# Altium project BlueStone_Terminal_V2.11.PrjPCB
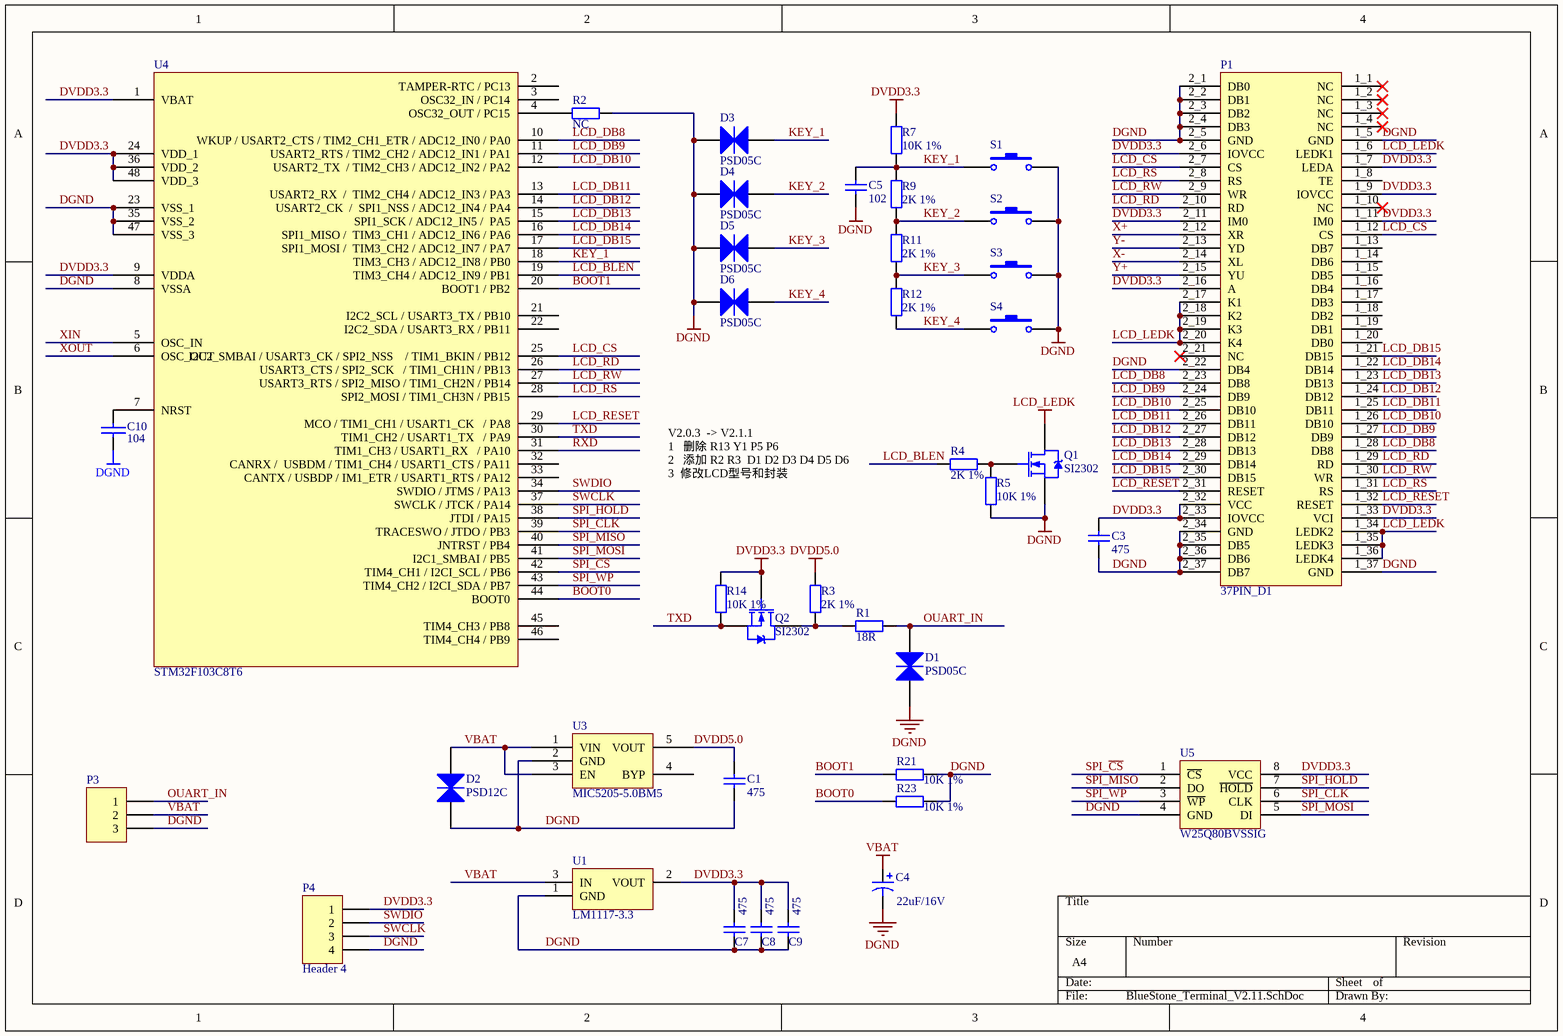
[diagram p0: BlueStone_Terminal_V2.11.SchDoc]
1 sheet, 39 parts. Net scope: global (net labels, ports and power ports of the same name join across sheets).
Board file: BlueStone_Terminal_V2.11.PcbDoc

## Sheet BlueStone_Terminal_V2.11.SchDoc
size A4

### Parts
C1  475  [1608(0603C)]
C3  475  [1608(0603C)]
C4  22uF/16V  [3216(1206B)]
C5  102  [1608(0603C)]
C7  475  [1608(0603C)]
C8  475  [1608(0603C)]
C9  475  [1608(0603C)]
C10  104  [1608(0603C)]
D1  PSD05C  [SOD523(0603R)]
D2  PSD12C  [SOD523(0603R)]
D3  PSD05C  [SOD523(0603R)]
D4  PSD05C  [SOD523(0603R)]
D5  PSD05C  [SOD523(0603R)]
D6  PSD05C  [SOD523(0603R)]
P1  37PIN_D1  [Z240_D1]
P3  (no value)  [SIP3]
P4  Header 4  [HDR1X4]
Q1  SI2302  [SOT-23]
Q2  SI2302  [SOT-23]
R1  18R  [1608(0603R)]
R2  NC  [1608(0603R)]
R3  2K 1%  [1608(0603R)]
R4  2K 1%  [1608(0603R)]
R5  10K 1%  [1608(0603R)]
R7  10K 1%  [1608(0603R)]
R9  2K 1%  [1608(0603R)]
R11  2K 1%  [1608(0603R)]
R12  2K 1%  [1608(0603R)]
R14  10K 1%  [1608(0603R)]
R21  10K 1%  [1608(0603R)]
R23  10K 1%  [1608(0603R)]
S1  (no value)  [KEY-3]
S2  (no value)  [KEY-3]
S3  (no value)  [KEY-3]
S4  (no value)  [KEY-3]
U1  LM1117-3.3  [SOT-223]
U3  MIC5205-5.0BM5  [SOT23-5]
U4  STM32F103C8T6  [LQFP48_N]
U5  W25Q80BVSSIG  [SO-8(Width: 7.8mm)]

### Nets
DGND: C1.2 C3.2 C4.2 C5.2 C7.2 C8.2 C9.2 C10.2 D1.1(A) D2.1(A) D3.1(A) D4.1(A) D5.1(A) D6.1(A) P1.1_5(GND) P1.1_37(GND) P1.2_1(DB0) P1.2_2(DB1) P1.2_3(DB2) P1.2_4(DB3) P1.2_5(GND) P1.2_22(DB4) P1.2_34(GND) P1.2_35(DB5) P1.2_36(DB6) P1.2_37(DB7) P3.3 P4.4 Q1.2(S) R2.2 R5.1 R21.2 R23.2 S1.2 S2.2 S3.2 S4.2 U1.1(GND) U3.2(GND) U4.8(VSSA) U4.23(VSS_1) U4.35(VSS_2) U4.47(VSS_3) U5.4(GND)
DVDD3.3: C3.1 C7.1 C8.1 C9.1 P1.1_7(LEDA) P1.1_9(IOVCC) P1.1_11(IM0) P1.1_33(VCI) P1.2_6(IOVCC) P1.2_11(IM0) P1.2_16(A) P1.2_32(VCC) P1.2_33(IOVCC) P4.1 Q2.1(G) R7.1 R14.2 U1.2(VOUT) U4.1(VBAT) U4.9(VDDA) U4.24(VDD_1) U4.36(VDD_2) U4.48(VDD_3) U5.8(VCC)
DVDD5.0: C1.1 R3.2 U3.5(VOUT)
LCD_LEDK: P1.1_6(LEDK1) P1.1_34(LEDK2) P1.1_35(LEDK3) P1.1_36(LEDK4) P1.2_17(K1) P1.2_18(K2) P1.2_19(K3) P1.2_20(K4) Q1.3(D)
VBAT: C4.1 D2.2(K) P3.2 U1.3(IN) U3.1(VIN) U3.3(EN)
BOOT0: R23.1 U4.44(BOOT0)
BOOT1: R21.1 U4.20(BOOT1_/_PB2)
KEY_1: C5.1 D3.2(K) R7.2 R9.1 S1.1 U4.18(TIM3_CH3_/_ADC12_IN8_/_PB0)
KEY_2: D4.2(K) R9.2 R11.1 S2.1
KEY_3: D5.2(K) R11.2 R12.1 S3.1
KEY_4: D6.2(K) R12.2 S4.1
LCD_BLEN: R4.2 U4.19(TIM3_CH4_/_ADC12_IN9_/_PB1)
LCD_CS: P1.1_12(CS) P1.2_7(CS) U4.25(I2C2_SMBAI_/_USART3_CK_/_SPI2_NSS____/_TIM1_BKIN_/_PB12)
LCD_DB8: P1.1_28(DB8) P1.2_23(DB8) U4.10(WKUP_/_USART2_CTS_/_TIM2_CH1_ETR_/_ADC12_IN0_/_PA0)
LCD_DB9: P1.1_27(DB9) P1.2_24(DB9) U4.11(USART2_RTS_/_TIM2_CH2_/_ADC12_IN1_/_PA1)
LCD_DB10: P1.1_26(DB10) P1.2_25(DB10) U4.12(USART2_TX__/_TIM2_CH3_/_ADC12_IN2_/_PA2)
LCD_DB11: P1.1_25(DB11) P1.2_26(DB11) U4.13(USART2_RX__/__TIM2_CH4_/_ADC12_IN3_/_PA3)
LCD_DB12: P1.1_24(DB12) P1.2_27(DB12) U4.14(USART2_CK__/__SPI1_NSS_/_ADC12_IN4_/_PA4)
LCD_DB13: P1.1_23(DB13) P1.2_28(DB13) U4.15(SPI1_SCK_/_ADC12_IN5_/__PA5)
LCD_DB14: P1.1_22(DB14) P1.2_29(DB14) U4.16(SPI1_MISO_/__TIM3_CH1_/_ADC12_IN6_/_PA6)
LCD_DB15: P1.1_21(DB15) P1.2_30(DB15) U4.17(SPI1_MOSI_/__TIM3_CH2_/_ADC12_IN7_/_PA7)
LCD_RD: P1.1_29(RD) P1.2_10(RD) U4.26(USART3_CTS_/_SPI2_SCK___/_TIM1_CH1N_/_PB13)
LCD_RESET: P1.1_32(RESET) P1.2_31(RESET) U4.29(MCO_/_TIM1_CH1_/_USART1_CK___/_PA8)
LCD_RS: P1.1_31(RS) P1.2_8(RS) U4.28(SPI2_MOSI_/_TIM1_CH3N_/_PB15)
LCD_RW: P1.1_30(WR) P1.2_9(WR) U4.27(USART3_RTS_/_SPI2_MISO_/_TIM1_CH2N_/_PB14)
OUART_IN: D1.2(K) P3.1 R1.1
RXD: U4.31(TIM1_CH3_/_USART1_RX___/_PA10)
SPI_~{CS}: U4.42(TIM4_CH1_/_I2CI_SCL_/_PB6) U5.1(~{CS})
SPI_CLK: U4.39(TRACESWO_/_JTDO_/_PB3) U5.6(CLK)
SPI_HOLD: U4.38(JTDI_/_PA15) U5.7(~{HOLD})
SPI_MISO: U4.40(JNTRST_/_PB4) U5.2(DO)
SPI_MOSI: U4.41(I2C1_SMBAI_/_PB5) U5.5(DI)
SPI_WP: U4.43(TIM4_CH2_/_I2CI_SDA_/_PB7) U5.3(~{WP})
SWCLK: P4.3 U4.37(SWCLK_/_JTCK_/_PA14)
SWDIO: P4.2 U4.34(SWDIO_/_JTMS_/_PA13)
TXD: Q2.2(S) R14.1 U4.30(TIM1_CH2_/_USART1_TX___/_PA9)
X+: P1.2_12(XR)
X-: P1.2_14(XL)
XIN: U4.5(OSC_IN)
XOUT: U4.6(OSC_OUT)
Y+: P1.2_15(YU)
Y-: P1.2_13(YD)
NetC10_1: C10.1 U4.7(NRST)
NetQ1_1: Q1.1(G) R4.1 R5.2
NetQ2_3: Q2.3(D) R1.2 R3.1
NetR2_1: R2.1 U4.4(OSC32_OUT_/_PC15)

Not connected (* = marked no-connect by the designer): P1 1_1(NC)* 1_2(NC)* 1_3(NC)* 1_4(NC)* 1_8(TE) 1_10(NC)* 1_13(DB7) 1_14(DB6) 1_15(DB5) 1_16(DB4) 1_17(DB3) 1_18(DB2) 1_19(DB1) 1_20(DB0) 2_21(NC)*; U3 4(BYP); U4 2(TAMPER-RTC_/_PC13) 3(OSC32_IN_/_PC14) 21(I2C2_SCL_/_USART3_TX_/_PB10) 22(I2C2_SDA_/_USART3_RX_/_PB11) 32(CANRX_/__USBDM_/_TIM1_CH4_/_USART1_CTS_/_PA11) 33(CANTX_/_USBDP_/_IM1_ETR_/_USART1_RTS_/_PA12) 45(TIM4_CH3_/_PB8) 46(TIM4_CH4_/_PB9)

### Notes on the sheet
- V2.0.3  -> V2.1.1
  1   删除 R13 Y1 P5 P6
  2   添加 R2 R3  D1 D2 D3 D4 D5 D6
  3  修改LCD型号和封装

### Library data of the parts
C1 C3 C5 C7-C9 = Cap: Capacitor; Value: 104; Published: 8-Jun-2000; LatestRevisionDate: 17-Jul-2002; LatestRevisionNote: Re-released for DXP Platform.; PackageReference: RAD-0.3; Publisher: Altium Limited
C4 = Cap Pol1: Polarized Capacitor (Radial); Value: 100pF; Published: 8-Jun-2000; LatestRevisionDate: 17-Jul-2002; LatestRevisionNote: Re-released for DXP Platform.; PackageReference: RB7.6-15; Publisher: Altium Limited
C10 = CAP: Capacitor
D1-D6 = RSBC6.8CS: Default Diode; Published: 8-Jun-2000; LatestRevisionDate: 17-Jul-2002; LatestRevisionNote: Re-released for DXP Platform.; PackageVersion: Sep-1996; PackageReference: SMC; Publisher: Altium Limited; PackageDescription: DO-214-AB/SMC; 2 C-Bend Leads; Body 7.9 x 5.9 mm, inc. leads (LxW); Code_JEDEC: DO-214-AB
P3 = Header 3: Header, 3-Pin; LatestRevisionDate: 17-Jul-2002; LatestRevisionNote: Re-released for DXP Platform.; Publisher: Altium Limited
P4 = Header 4: Header, 4-Pin; LatestRevisionDate: 17-Jul-2002; LatestRevisionNote: Re-released for DXP Platform.; Publisher: Altium Limited
Q1 Q2 = NMOS  (SOT23)
R1 R3 R14 = Res2: Resistor; Published: 8-Jun-2000; LatestRevisionDate: 17-Jul-2002; LatestRevisionNote: Re-released for DXP Platform.; PackageReference: AXIAL-0.4; Publisher: Altium Limited
R2 R4 R5 R7 R9 R11 R12 R21 R23 = Res2: Resistor; Value: 1K; Published: 8-Jun-2000; LatestRevisionDate: 17-Jul-2002; LatestRevisionNote: Re-released for DXP Platform.; PackageReference: AXIAL-0.4; Publisher: Altium Limited
S1-S4 = SW-PB: Switch; Published: 24-Mar-1999; LatestRevisionDate: 17-Jul-2002; LatestRevisionNote: Re-released for DXP Platform.; PackageReference: SPST-2; Publisher: Altium Limited; PackageDescription: Switch; 2 Leads
U1 = LM1117
U3 = MIC5205
U4 = STM32F103C
U5 = W55X16